# EAGLE design CityFireFly_3.1v (EAGLE 7.5.0)
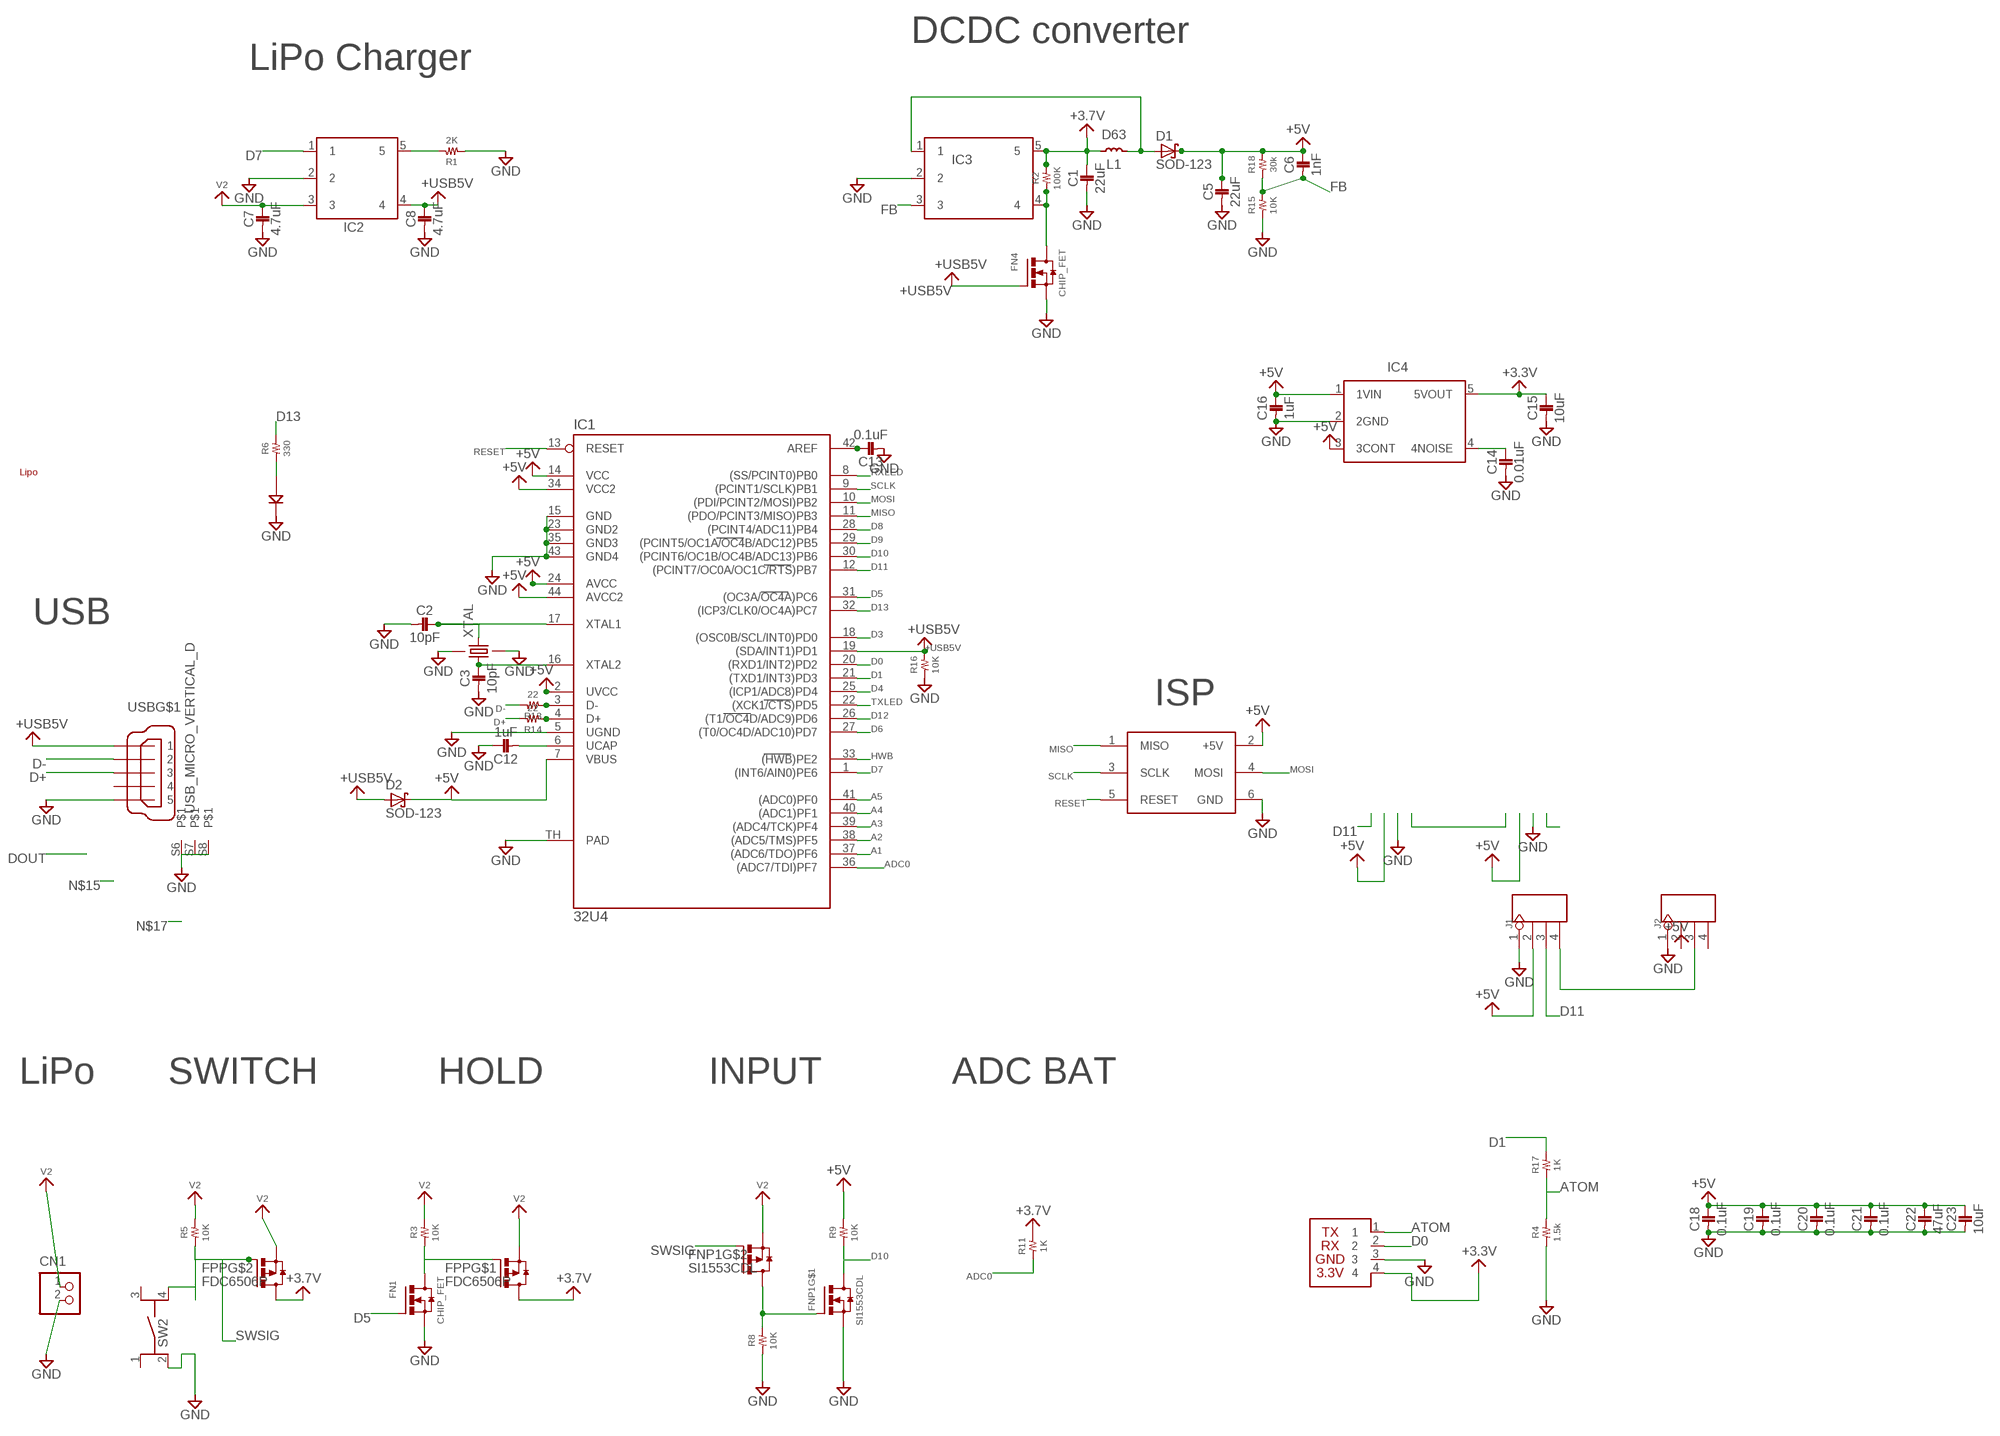
[diagram p0: schematic, sheet 1]

## Parts
BLE  BLE_SERIAL2_NO_HOLE  [BLESERIAL2_NO_HOLE]
C1  22uF  1608  [1608]
C2  10pF  1005  [1005]
C3  10pF  1005  [1005]
C5  22uF  1608  [1608]
C6  1nF  1005  [1005]
C7  4.7uF  1005  [1005]
C8  4.7uF  1005  [1005]
C12  1uF  1005  [1005]
C13  0.1uF  1005  [1005]
C14  0.01uF  1608  [1608]
C15  10uF  1608  [1608]
C16  1uF  1005  [1005]
C18  0.1uF  1005  [1005]
C19  0.1uF  1005  [1005]
C20  0.1uF  1005  [1005]
C21  0.1uF  1005  [1005]
C22  47uF  1608  [1608]
C23  10uF  1608  [1608]
CN1  S2B-PH-K-S  [S2B-PH-K-S]
D1  SOD-123  [SOD_123]
D2  SOD-123  [SOD_123]
FN1  CHIP_FET  [SOT23]
FN4  CHIP_FET  [SOT23]
FNP1  SI1553CDL  [SOT363]
FPP  FDC6506P  [SOT23-6]
IC1  32U4  ATMEGA32U4  [QFN-44-7X7]
IC2  MCP73831  [SOT23-5L]
IC3  LM2735  [SOT23-5L]
IC4  TAR5SB  [SSOP5-P-0.95]
J1  HEADER-4PFEMALE-LEFT  [4P-2.0-65/35MIL-90D-FEMALE-LEFT]
J2  HEADER-4PFEMALE-LEFT  [4P-2.0-65/35MIL-90D-FEMALE-LEFT]
L1  D63  [TOKO]
LED1  3MMLED  [3MM]
R1  2K  RESISTOR_1005  [1005]
R2  100K  RESISTOR_1005  [1005]
R3  10K  RESISTOR_1005  [1005]
R4  1.5k  RESISTOR_1005  [1005]
R5  10K  RESISTOR_1005  [1005]
R6  330  RESISTOR_1005  [1005]
R8  10K  RESISTOR_1005  [1005]
R9  10K  RESISTOR_1005  [1005]
R11  1K  RESISTOR_1005  [1005]
R13  22  RESISTOR_1005  [1005]
R14  22  RESISTOR_1005  [1005]
R15  10K  RESISTOR_1005  [1005]
R16  10K  RESISTOR_1005  [1005]
R17  1K  RESISTOR_1005  [1005]
R18  30k  RESISTOR_1005  [1005]
SW2  SKRPACE010  [SKRP]
U$3  ICSP  [ICSP]
U$68  LIPO500MAH  [LIPO500MAH]
USB  USB_MICRO_VERTICAL_D  [USB_MICRO_VERTICAL_D]
XTAL  FA-238  [FA-238]

## Nets
+3.3V: BLE.4 C15.P$1 IC4.5(5VOUT)
+3.7V: C1.P$1 FPP.4(D) FPP.6(D) IC3.5 L1.1 R2.2 R11.2
+5V: C5.P$1 C6.1 C16.1 C18.1 C19.1 C20.1 C21.1 C22.P$1 C23.P$1 D1.C D2.C IC1.2(UVCC) IC1.7(VBUS) IC1.14(VCC) IC1.24(AVCC) IC1.34(VCC2) IC1.44(AVCC2) IC4.1(1VIN) IC4.3(3CONT) J1.2 J2.2 R9.2 R18.2 U$3.2(+5V)
+USB5V: C8.1 D2.A FN4.1(G) IC1.19((SDA/INT1)PD1) IC2.4 R16.2 USB.1
A1: IC1.37((ADC6/TDO)PF6)
A2: IC1.38((ADC5/TMS)PF5)
A3: IC1.39((ADC4/TCK)PF4)
A4: IC1.40((ADC1)PF1)
A5: IC1.41((ADC0)PF0)
ADC0: IC1.36((ADC7/TDI)PF7) R11.1
ATOM: BLE.1 R4.2 R17.1
D0: BLE.2 IC1.20((RXD1/INT2)PD2)
D1: IC1.21((TXD1/INT3)PD3) R17.2
D3: IC1.18((OSC0B/SCL/INT0)PD0)
D4: IC1.25((ICP1/ADC8)PD4)
D5: FN1.1(G) IC1.31((OC3A/OC4A)PC6)
D6: IC1.27((T0/OC4D/ADC10)PD7)
D7: IC1.1((INT6/AIN0)PE6) IC2.1
D8: IC1.28((PCINT4/ADC11)PB4)
D9: IC1.29((PCINT5/OC1A/OC4B/ADC12)PB5)
D10: FNP1.6(D) IC1.30((PCINT6/OC1B/OC4B/ADC13)PB6) R9.1
D11: IC1.12((PCINT7/OC0A/OC1C/RTS)PB7) J1.3
D12: IC1.26((T1/OC4D/ADC9)PD6)
D13: IC1.32((ICP3/CLK0/OC4A)PC7) R6.2
D+: R14.2 USB.3
D-: R13.2 USB.2
DL: D1.A IC3.1 L1.2
DOUT: J1.4 J2.3
FB: C6.2 IC3.3 R15.2 R18.1
GND: BLE.3 C1.P$2 C2.2 C3.2 C5.P$2 C7.2 C8.2 C12.1 C13.2 C14.P$2 C15.P$2 C16.2 C18.2 C19.2 C20.2 C21.2 C22.P$2 C23.P$2 CN1.2 FN1.2(S) FN4.2(S) FNP1.1(S) IC1.5(UGND) IC1.15(GND) IC1.23(GND2) IC1.35(GND3) IC1.43(GND4) IC1.TH(PAD) IC2.2 IC3.2 IC4.2(2GND) J1.1 J2.1 LED1.K R1.1 R4.1 R8.1 R15.1 R16.1 SW2.2(1_) U$3.6(GND) USB.5 USB.S6 USB.S7 USB.S8 XTAL.2 XTAL.4
HWB: IC1.33((HWB)PE2)
MISO: IC1.11((PDO/PCINT3/MISO)PB3) U$3.1(MISO)
MOSI: IC1.10((PDI/PCINT2/MOSI)PB2) U$3.4(MOSI)
N$1: LED1.A R6.1
N$2: IC2.5 R1.2
N$3: FN4.3(D) IC3.4 R2.1
N$6: FN1.3(D) FPP.1(G) R3.1
N$7: C3.1 IC1.16(XTAL2) XTAL.1
N$8: IC1.3(D-) R13.1
N$9: C13.1 IC1.42(AREF)
N$10: C2.1 IC1.17(XTAL1) XTAL.3
N$14: IC1.4(D+) R14.1
N$16: C14.P$1 IC4.4(4NOISE)
N$18: C12.2 IC1.6(UCAP)
RESET: IC1.13(RESET) U$3.5(RESET)
RXLED: IC1.8((SS/PCINT0)PB0)
SCLK: IC1.9((PCINT1/SCLK)PB1) U$3.3(SCLK)
SIG: FNP1.2(G) FNP1.3(D) R8.2
SWSIG: FNP1.5(G) FPP.3(G) R5.1 SW2.4(2_)
TXLED: IC1.22((XCK1/CTS)PD5)
V2: C7.1 CN1.1 FNP1.4(S) FPP.2(S) FPP.5(S) IC2.3 R3.2 R5.2
Unconnected: J2.4 SW2.1 SW2.3 USB.4

## Notes on the sheet
- DCDC converter
- LiPo Charger
- USB
- ISP
- LiPo | SWITCH | HOLD | INPUT | ADC BAT

## Library data of the parts
BLE = 12_module:BLE_SERIAL2_NO_HOLE
C1 C5 C14 C15 C22 C23 = 02_C:1608
C2 C3 C6-C8 C12 C13 C16 C18-C21 = 02_C:1005
CN1 = jst-ph1:S2B-PH-*: Wire-to-Board 2.0mm pitch side mount connector Source: http://www.jst-mfg.com/product/pdf/jpn/PH.pdf http://www.jst-mfg.com/product/detail.php?series=199
D1 D2 = 15_DIODE:SOD-123
FN1 FN4 = 06_FET:CHIP_FET
FNP1 = 06_FET:SI1553CDL
FPP = 06_FET:FDC6506P
IC1 = 04_IC:ATMEGA32U4
IC2 = 04_IC:MCP73831
IC3 = 04_IC:LM2735
IC4 = 04_IC:TAR5SB
J1 J2 = Connector :HEADER-4P
L1 = 03_L:D63
LED1 = 10_LED:3MMLED
R1-R6 R8 R9 R11 R13-R18 = 01_R:RESISTOR_1005
SW2 = 09_1_switch:SKRPACE010
U$3 = 08_CONECTOR:ICSP
U$68 = 16_battery:LIPO500MAH
USB = 08_CONECTOR:USB_MICRO_VERTICAL_D
XTAL = 09_2_CRYSTAL:FA-238

## Net classes
1 POWER: width 0.5 mm, clearance 0.5 mm

## Board
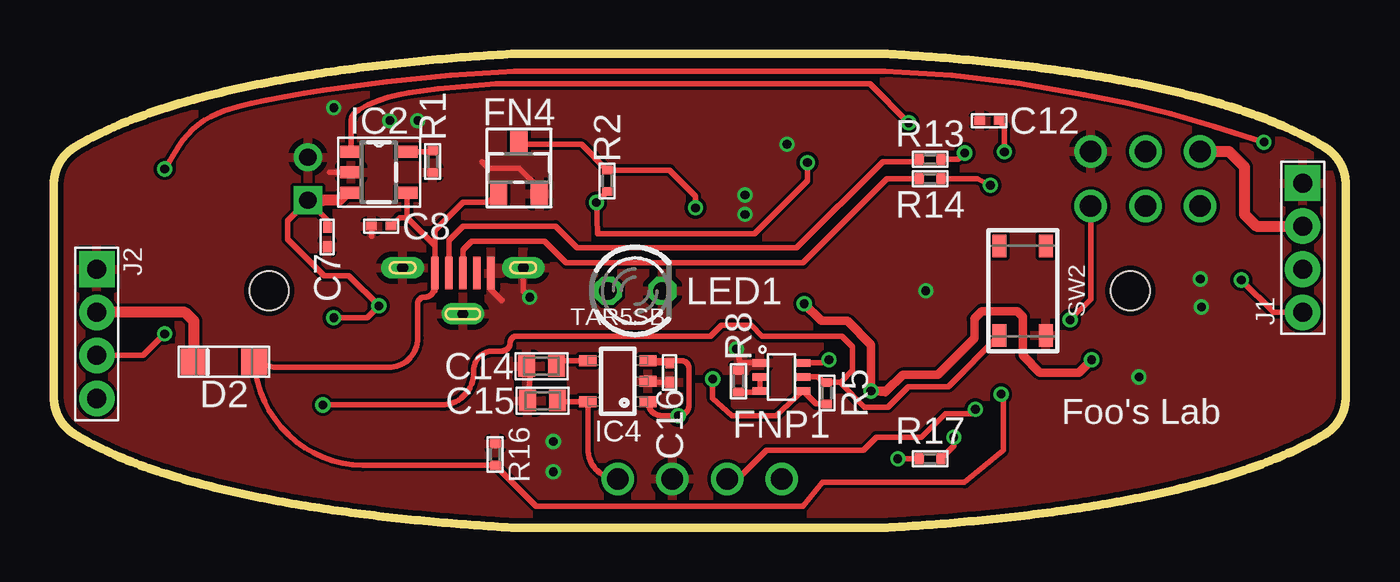
[diagram p1: board, top side]
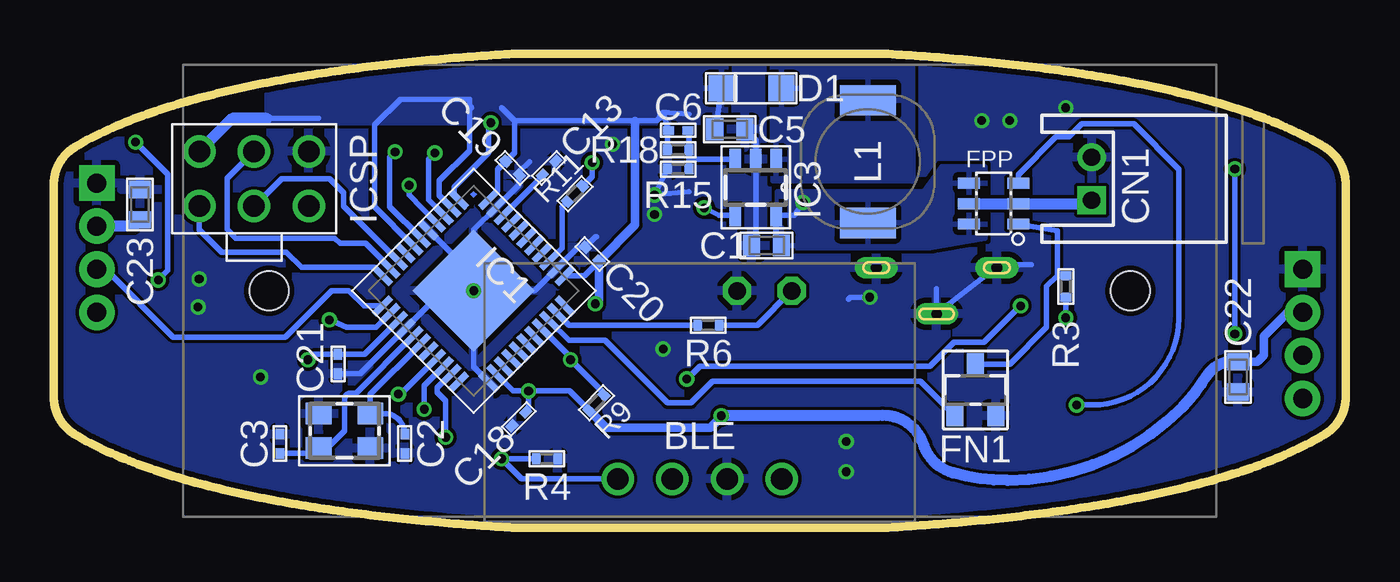
[diagram p2: board, bottom side, seen from below]

Size 60 x 22 mm. Coordinates in mm from the lower left corner, seen from the top.
Outline: 38.6,0 38.61,0 38.62,0 38.62,0 38.63,0 38.63,0 38.64,0 38.65,0 38.66,0 38.66,0 38.67,0 38.68,0 38.68,0 38.69,0 38.7,0 38.7,0 38.71,0 38.72,0 38.83,0.01 39.05,0.02 39.26,0.04 39.48,0.05 39.7,0.07 39.91,0.08 40.13,0.1 40.34,0.11 40.56,0.13 40.77,0.14 40.99,0.16 41.21,0.18 41.42,0.19 41.64,0.21 41.85,0.23 42.07,0.25 42.28,0.27 42.5,0.29 42.71,0.31 42.93,0.33 43.15,0.35 43.36,0.37 43.58,0.39 43.79,0.42 44.01,0.44 44.22,0.46 44.44,0.49 44.65,0.51 44.87,0.54 45.08,0.56 45.3,0.59 45.51,0.61 45.73,0.64 45.94,0.67 46.16,0.7 46.37,0.73 46.59,0.76 46.8,0.79 47.01,0.82 47.23,0.85 47.44,0.88 47.66,0.91 47.87,0.94 48.09,0.98 48.3,1.01 48.51,1.05 48.73,1.08 48.94,1.12 49.16,1.16 49.37,1.2 49.58,1.24 49.8,1.28 50.01,1.32 50.23,1.36 50.44,1.4 50.65,1.44 50.87,1.49 51.08,1.53 51.29,1.58 51.51,1.63 51.72,1.67 51.93,1.72 52.14,1.77 52.35,1.82 52.56,1.88 52.78,1.93 52.99,1.98 53.2,2.04 53.41,2.09 53.62,2.15 53.83,2.21 54.03,2.27 54.24,2.33 54.45,2.4 54.66,2.46 54.87,2.52 55.07,2.59 55.28,2.66 55.49,2.73 55.69,2.8 55.9,2.88 56.1,2.95 56.31,3.03 56.51,3.11 56.71,3.19 56.91,3.27 57.11,3.36 57.31,3.45 57.51,3.54 57.71,3.63 57.91,3.72 58.1,3.82 58.3,3.92 58.49,4.02 58.68,4.13 58.87,4.24 59.04,4.34 59.05,4.35 59.06,4.35 59.06,4.36 59.07,4.36 59.07,4.36 59.08,4.37 59.08,4.37 59.09,4.37 59.09,4.38 59.1,4.38 59.1,4.38 59.11,4.39 59.12,4.39 59.12,4.39 59.13,4.4 59.13,4.4 59.14,4.41 59.14,4.41 59.15,4.41 59.15,4.42 59.16,4.42 59.16,4.42 59.17,4.43 59.17,4.43 59.18,4.44 59.19,4.44 59.19,4.44 59.2,4.45 59.2,4.45 59.21,4.46 59.21,4.46 59.22,4.46 59.22,4.47 59.23,4.47 59.23,4.48 59.24,4.48 59.24,4.49 59.25,4.49 59.25,4.49 59.26,4.5 59.26,4.5 59.27,4.51 59.27,4.51 59.28,4.51 59.28,4.52 59.29,4.52 59.3,4.53 59.3,4.53 59.31,4.54 59.31,4.54 59.32,4.54 59.33,4.55 59.33,4.56 59.34,4.56 59.34,4.57 59.35,4.57 59.35,4.58 59.36,4.58 59.36,4.58 59.37,4.59 59.37,4.59 59.38,4.6 59.38,4.6 59.39,4.61 59.39,4.61 59.4,4.62 59.41,4.63 59.41,4.63 59.41,4.64 59.42,4.64 59.42,4.65 59.43,4.65 59.43,4.66 59.44,4.66 59.44,4.67 59.45,4.67 59.45,4.68 59.46,4.68 59.46,4.69 59.47,4.69 59.47,4.7 59.48,4.7 59.48,4.71 59.48,4.71 59.49,4.72 59.49,4.72 59.5,4.73 59.51,4.74 59.51,4.74 59.52,4.75 59.52,4.75 59.53,4.76 59.53,4.76 59.53,4.77 59.54,4.77 59.54,4.78 59.55,4.78 59.55,4.79 59.56,4.79 59.56,4.8 59.56,4.8 59.57,4.81 59.57,4.82 59.58,4.82 59.58,4.83 59.59,4.83 59.59,4.84 59.59,4.84 59.6,4.85 59.6,4.85 59.61,4.86 59.61,4.87 59.62,4.87 59.62,4.88 59.63,4.89 59.63,4.89 59.63,4.9 59.64,4.91 59.64,4.91 59.65,4.92 59.65,4.92 59.65,4.93 59.66,4.93 59.66,4.94 59.67,4.94 59.67,4.95 59.67,4.96 59.68,4.96 59.68,4.97 59.69,4.97 59.69,4.98 59.69,4.99 59.7,4.99 59.7,5 59.7,5 59.71,5.01 59.71,5.02 59.72,5.03 59.72,5.03 59.73,5.04 59.73,5.04 59.73,5.05 59.73,5.06 59.74,5.06 59.74,5.07 59.74,5.07 59.75,5.08 59.75,5.09 59.76,5.09 59.76,5.1 59.76,5.11 59.77,5.11 59.77,5.12 59.77,5.12 59.78,5.13 59.78,5.14 59.78,5.15 59.79,5.16 59.79,5.17 59.8,5.18 59.81,5.2 59.81,5.2 59.81,5.21 59.82,5.22 59.82,5.22 59.82,5.23 59.83,5.24 59.83,5.24 59.83,5.25 59.83,5.25 59.84,5.26 59.84,5.27 59.84,5.27 59.85,5.28 59.85,5.29 59.85,5.29 59.85,5.3 59.86,5.31 59.86,5.32 59.87,5.33 59.87,5.34 59.87,5.34 59.87,5.35 59.88,5.37 59.88,5.38 59.88,5.38 59.89,5.39 59.89,5.39 59.89,5.4 59.89,5.41 59.9,5.42 59.9,5.42 59.9,5.43 59.9,5.43 59.9,5.44 59.91,5.45 59.91,5.46 59.91,5.47 59.92,5.49 59.92,5.49 59.92,5.51 59.93,5.51 59.93,5.52 59.93,5.53 59.93,5.53 59.93,5.54 59.94,5.55 59.94,5.55 59.94,5.56 59.94,5.57 59.94,5.57 59.95,5.58 59.95,5.59 59.95,5.62 59.95,5.62 59.96,5.64 59.96,5.64 59.96,5.65 59.96,5.66 59.96,5.67 59.96,5.67 59.97,5.68 59.97,5.68 59.97,5.69 59.97,5.7 59.97,5.7 59.97,5.71 59.97,5.72 59.97,5.72 59.97,5.73 59.98,5.74 59.98,5.74 59.98,5.75 59.98,5.76 59.98,5.76 59.98,5.77 59.98,5.78 59.98,5.79 59.98,5.8 59.98,5.8 59.99,5.81 59.99,5.82 59.99,5.82 59.99,5.83 59.99,5.84 59.99,5.85 59.99,5.86 59.99,5.87 59.99,5.89 59.99,5.9 59.99,5.9 59.99,5.91 59.99,5.92 60,5.92 60,5.93 60,5.94 60,5.95 60,5.96 60,5.97 60,5.97 60,5.98 60,6 60,6 60,6.01 60,6.02 60,15.97 60,15.98 60,16 60,16 60,16.01 60,16.02 60,16.02 60,16.03 60,16.04 60,16.05 60,16.05 60,16.07 59.99,16.08 59.99,16.08 59.99,16.09 59.99,16.1 59.99,16.1 59.99,16.11 59.99,16.12 59.99,16.12 59.99,16.14 59.99,16.15 59.99,16.16 59.99,16.17 59.99,16.18 59.99,16.18 59.98,16.19 59.98,16.2 59.98,16.2 59.98,16.21 59.98,16.22 59.98,16.22 59.98,16.24 59.98,16.24 59.98,16.25 59.98,16.26 59.98,16.26 59.97,16.27 59.97,16.28 59.97,16.28 59.97,16.29 59.97,16.3 59.97,16.3 59.97,16.31 59.97,16.32 59.97,16.32 59.96,16.33 59.96,16.34 59.96,16.35 59.96,16.36 59.96,16.36 59.95,16.38 59.95,16.38 59.95,16.4 59.95,16.41 59.94,16.43 59.94,16.43 59.94,16.44 59.94,16.45 59.93,16.45 59.93,16.46 59.93,16.47 59.93,16.47 59.93,16.48 59.92,16.49 59.92,16.49 59.91,16.55 59.91,16.55 59.9,16.56 59.9,16.57 59.9,16.57 59.9,16.58 59.89,16.59 59.89,16.6 59.89,16.61 59.89,16.61 59.88,16.62 59.88,16.62 59.88,16.64 59.88,16.64 59.87,16.66 59.86,16.68 59.86,16.68 59.85,16.7 59.85,16.71 59.85,16.71 59.84,16.73 59.84,16.73 59.84,16.74 59.83,16.75 59.83,16.75 59.83,16.76 59.83,16.77 59.82,16.77 59.82,16.78 59.82,16.78 59.81,16.79 59.81,16.8 59.8,16.82 59.8,16.82 59.8,16.83 59.79,16.83 59.79,16.84 59.79,16.85 59.78,16.85 59.78,16.86 59.78,16.86 59.77,16.88 59.77,16.88 59.76,16.89 59.76,16.89 59.76,16.9 59.76,16.91 59.75,16.91 59.75,16.92 59.74,16.93 59.73,16.95 59.72,16.96 59.72,16.97 59.72,16.97 59.71,16.98 59.7,17 59.7,17 59.7,17.01 59.69,17.02 59.69,17.02 59.68,17.03 59.68,17.03 59.68,17.04 59.67,17.04 59.67,17.05 59.66,17.06 59.66,17.07 59.64,17.09 59.63,17.1 59.63,17.11 59.63,17.11 59.62,17.12 59.62,17.12 59.61,17.13 59.6,17.14 59.6,17.14 59.6,17.15 59.59,17.16 59.59,17.16 59.58,17.17 59.58,17.17 59.58,17.18 59.57,17.18 59.57,17.19 59.56,17.19 59.56,17.2 59.55,17.2 59.55,17.21 59.54,17.22 59.54,17.23 59.52,17.24 59.51,17.26 59.5,17.27 59.48,17.29 59.47,17.3 59.47,17.3 59.47,17.31 59.46,17.31 59.46,17.32 59.45,17.33 59.44,17.33 59.44,17.34 59.43,17.34 59.43,17.35 59.42,17.35 59.42,17.36 59.41,17.37 59.4,17.37 59.4,17.38 59.39,17.38 59.39,17.39 59.38,17.39 59.38,17.4 59.37,17.41 59.36,17.41 59.35,17.42 59.34,17.43 59.34,17.43 59.33,17.44 59.33,17.44 59.33,17.45 59.32,17.45 59.31,17.45 59.3,17.46 59.29,17.47 59.29,17.48 59.28,17.48 59.27,17.49 59.27,17.49 59.26,17.5 59.26,17.5 59.25,17.51 59.25,17.51 59.24,17.52 59.24,17.52 59.23,17.52 59.23,17.53 59.22,17.53 59.22,17.54 59.21,17.54 59.21,17.54 59.2,17.55 59.2,17.55 59.18,17.56 59.18,17.56 59.17,17.57 59.17,17.57 59.16,17.57 59.16,17.58 59.15,17.59 59.14,17.59 59.14,17.59 59.12,17.6 59.11,17.61 59.1,17.61 59.1,17.62 59.08,17.63 59.06,17.64 59.06,17.64 59.05,17.65 59,17.68 58.82,17.79 58.63,17.9 58.44,18 58.25,18.1 58.05,18.2 57.86,18.3 57.67,18.39 57.47,18.48 57.27,18.57 57.08,18.66 56.88,18.74 56.68,18.82 56.48,18.9 56.28,18.98 56.08,19.05 55.88,19.13 55.68,19.2 55.48,19.27 55.28,19.34 55.07,19.41 54.87,19.47 54.67,19.54 54.46,19.6 54.26,19.66 54.05,19.72 53.85,19.78 53.64,19.84 53.44,19.9 53.23,19.95 53.02,20.01 52.82,20.06 52.61,20.11 52.4,20.16 52.2,20.21 51.99,20.26 51.78,20.31 51.57,20.36 51.36,20.41 51.15,20.45 50.94,20.5 50.73,20.54 50.52,20.58 50.31,20.62 50.1,20.66 49.89,20.7 49.68,20.75 49.47,20.78 49.26,20.82 49.04,20.86 48.83,20.9 48.62,20.93 48.41,20.97 48.2,21 47.99,21.04 47.77,21.07 47.56,21.1 47.35,21.13 47.14,21.16 46.93,21.2 46.72,21.23 46.5,21.25 46.29,21.28 46.08,21.31 45.87,21.34 45.65,21.37 45.44,21.39 45.23,21.42 45.02,21.45 44.8,21.47 44.59,21.5 44.38,21.52 44.17,21.54 43.95,21.57 43.74,21.59 43.53,21.61 43.32,21.63 43.1,21.65 42.89,21.68 42.68,21.7 42.47,21.71 42.25,21.73 42.04,21.75 41.83,21.77 41.62,21.79 41.4,21.81 41.19,21.82 40.98,21.84 40.76,21.86 40.55,21.87 40.34,21.89 40.12,21.91 39.91,21.92 39.7,21.93 39.48,21.95 39.27,21.96 39.06,21.98 38.84,21.99 38.72,22 38.71,22 38.7,22 38.7,22 38.69,22 38.68,22 38.68,22 38.67,22 38.66,22 38.65,22 38.64,22 38.64,22 38.62,22 38.62,22 38.61,22 21.39,22 21.39,22 21.38,22 21.37,22 21.37,22 21.36,22 21.35,22 21.34,22 21.33,22 21.32,22 21.31,22 21.3,22 21.29,22 21.27,22 21.05,21.98 20.84,21.97 20.62,21.96 20.41,21.94 20.19,21.93 19.97,21.91 19.76,21.9 19.54,21.88 19.33,21.87 19.11,21.85 18.89,21.83 18.68,21.82 18.46,21.8 18.25,21.78 18.03,21.76 17.82,21.74 17.6,21.72 17.39,21.7 17.17,21.68 16.95,21.66 16.74,21.64 16.52,21.62 16.31,21.6 16.09,21.57 15.88,21.55 15.66,21.53 15.45,21.5 15.23,21.48 15.02,21.45 14.8,21.43 14.59,21.4 14.37,21.37 14.16,21.34 13.95,21.32 13.73,21.29 13.52,21.26 13.3,21.23 13.09,21.2 12.87,21.17 12.66,21.14 12.44,21.11 12.23,21.07 12.01,21.04 11.8,21 11.59,20.97 11.37,20.93 11.16,20.9 10.94,20.86 10.73,20.82 10.52,20.78 10.3,20.74 10.09,20.7 9.87,20.66 9.66,20.62 9.45,20.58 9.23,20.53 9.02,20.49 8.81,20.44 8.6,20.4 8.38,20.35 8.17,20.3 7.96,20.25 7.75,20.2 7.53,20.15 7.32,20.1 7.11,20.04 6.9,19.99 6.69,19.93 6.48,19.88 6.27,19.82 6.06,19.76 5.85,19.7 5.64,19.64 5.44,19.57 5.23,19.51 5.02,19.44 4.82,19.37 4.61,19.3 4.4,19.23 4.2,19.16 3.99,19.09 3.79,19.01 3.59,18.93 3.38,18.85 3.18,18.77 2.98,18.68 2.78,18.6 2.58,18.51 2.38,18.42 2.19,18.32 1.99,18.23 1.79,18.13 1.6,18.03 1.41,17.92 1.22,17.82 1.03,17.7 0.95,17.66 0.95,17.65 0.94,17.65 0.94,17.64 0.93,17.64 0.93,17.64 0.92,17.63 0.91,17.63 0.91,17.63 0.9,17.62 0.9,17.62 0.89,17.62 0.89,17.61 0.88,17.61 0.88,17.61 0.87,17.6 0.86,17.6 0.86,17.59 0.85,17.59 0.85,17.59 0.84,17.58 0.84,17.58 0.83,17.58 0.83,17.57 0.82,17.57 0.81,17.56 0.81,17.56 0.8,17.55 0.79,17.54 0.79,17.54 0.78,17.54 0.77,17.53 0.77,17.53 0.76,17.52 0.76,17.52 0.75,17.52 0.75,17.51 0.74,17.51 0.74,17.5 0.73,17.5 0.73,17.49 0.72,17.49 0.72,17.49 0.71,17.48 0.71,17.48 0.7,17.47 0.69,17.46 0.68,17.45 0.67,17.45 0.66,17.44 0.66,17.43 0.65,17.43 0.65,17.42 0.64,17.42 0.64,17.41 0.63,17.41 0.63,17.41 0.62,17.4 0.62,17.4 0.61,17.39 0.61,17.39 0.6,17.38 0.6,17.38 0.59,17.37 0.59,17.37 0.58,17.36 0.58,17.36 0.57,17.35 0.57,17.35 0.56,17.34 0.56,17.34 0.56,17.33 0.55,17.33 0.55,17.32 0.54,17.32 0.54,17.31 0.53,17.31 0.53,17.3 0.52,17.3 0.52,17.29 0.51,17.29 0.51,17.28 0.5,17.28 0.5,17.27 0.49,17.27 0.49,17.26 0.49,17.26 0.48,17.25 0.48,17.25 0.47,17.24 0.47,17.24 0.46,17.23 0.46,17.23 0.46,17.22 0.45,17.22 0.45,17.21 0.44,17.2 0.44,17.2 0.43,17.19 0.43,17.19 0.42,17.18 0.42,17.18 0.42,17.17 0.41,17.17 0.41,17.16 0.4,17.16 0.4,17.15 0.4,17.14 0.39,17.14 0.39,17.13 0.38,17.13 0.38,17.12 0.38,17.12 0.37,17.11 0.37,17.11 0.36,17.1 0.36,17.09 0.35,17.09 0.35,17.08 0.35,17.08 0.34,17.07 0.34,17.07 0.34,17.06 0.33,17.05 0.33,17.05 0.32,17.04 0.32,17.04 0.32,17.03 0.31,17.03 0.31,17.02 0.31,17.01 0.3,17.01 0.3,17 0.29,17 0.29,16.99 0.29,16.98 0.28,16.98 0.28,16.97 0.28,16.97 0.27,16.96 0.27,16.95 0.27,16.95 0.26,16.94 0.26,16.94 0.26,16.93 0.25,16.93 0.25,16.92 0.25,16.91 0.24,16.91 0.24,16.9 0.24,16.89 0.23,16.89 0.23,16.88 0.23,16.88 0.22,16.87 0.22,16.86 0.22,16.86 0.21,16.85 0.21,16.84 0.21,16.84 0.2,16.83 0.2,16.83 0.2,16.82 0.2,16.81 0.19,16.81 0.19,16.8 0.19,16.8 0.18,16.79 0.18,16.78 0.18,16.78 0.17,16.77 0.17,16.76 0.17,16.76 0.17,16.75 0.16,16.75 0.16,16.74 0.16,16.73 0.16,16.73 0.15,16.72 0.15,16.71 0.15,16.71 0.15,16.7 0.14,16.69 0.14,16.69 0.14,16.68 0.14,16.68 0.13,16.67 0.13,16.66 0.13,16.66 0.13,16.65 0.12,16.64 0.12,16.64 0.12,16.63 0.12,16.62 0.11,16.62 0.11,16.61 0.11,16.6 0.11,16.6 0.1,16.59 0.1,16.58 0.1,16.58 0.1,16.57 0.1,16.57 0.09,16.56 0.09,16.55 0.09,16.55 0.09,16.54 0.09,16.53 0.08,16.53 0.08,16.52 0.08,16.51 0.08,16.51 0.08,16.5 0.07,16.49 0.07,16.49 0.07,16.48 0.07,16.47 0.07,16.47 0.07,16.46 0.06,16.45 0.06,16.45 0.06,16.44 0.06,16.43 0.06,16.43 0.06,16.42 0.05,16.41 0.05,16.41 0.05,16.4 0.05,16.39 0.05,16.39 0.05,16.38 0.04,16.37 0.04,16.37 0.04,16.36 0.04,16.35 0.04,16.35 0.04,16.34 0.04,16.33 0.04,16.33 0.03,16.32 0.03,16.31 0.03,16.31 0.03,16.3 0.03,16.29 0.03,16.29 0.03,16.28 0.03,16.27 0.03,16.27 0.02,16.26 0.02,16.25 0.02,16.25 0.02,16.24 0.02,16.23 0.02,16.23 0.02,16.22 0.02,16.21 0.02,16.21 0.02,16.2 0.01,16.2 0.01,16.19 0.01,16.18 0.01,16.18 0.01,16.17 0.01,16.16 0.01,16.16 0.01,16.15 0.01,16.14 0.01,16.14 0.01,16.13 0.01,16.12 0.01,16.12 0.01,16.11 0.01,16.1 0.01,16.1 0.01,16.09 0,16.08 0,16.08 0,16.07 0,16.06 0,16.06 0,16.05 0,16.04 0,16.04 0,16.03 0,16.02 0,16.02 0,16.01 0,16 0,16 0,15.99 0,15.98 0,15.98 0,15.97 0,15.96 0,15.96 0,15.95 0,6.05 0,6.04 0,6.04 0,6.03 0,6.02 0,6.01 0,6.01 0,6 0,6 0,5.99 0,5.98 0,5.98 0,5.97 0,5.96 0,5.96 0,5.95 0,5.94 0,5.94 0,5.93 0,5.92 0,5.92 0.01,5.91 0.01,5.9 0.01,5.9 0.01,5.89 0.01,5.88 0.01,5.88 0.01,5.87 0.01,5.86 0.01,5.86 0.01,5.85 0.01,5.84 0.01,5.84 0.01,5.83 0.01,5.83 0.01,5.82 0.01,5.81 0.01,5.8 0.02,5.8 0.02,5.79 0.02,5.79 0.02,5.78 0.02,5.77 0.02,5.76 0.02,5.76 0.02,5.75 0.02,5.75 0.02,5.74 0.03,5.73 0.03,5.73 0.03,5.72 0.03,5.71 0.03,5.71 0.03,5.7 0.03,5.69 0.03,5.69 0.04,5.68 0.04,5.67 0.04,5.67 0.04,5.66 0.04,5.65 0.04,5.65 0.04,5.64 0.04,5.63 0.05,5.63 0.05,5.62 0.05,5.61 0.05,5.61 0.05,5.6 0.05,5.59 0.06,5.59 0.06,5.58 0.06,5.57 0.06,5.57 0.06,5.56 0.06,5.55 0.07,5.55 0.07,5.54 0.07,5.53 0.07,5.53 0.07,5.52 0.07,5.51 0.07,5.51 0.08,5.5 0.08,5.49 0.08,5.49 0.08,5.48 0.09,5.47 0.09,5.47 0.09,5.46 0.09,5.46 0.09,5.45 0.1,5.44 0.1,5.43 0.1,5.43 0.1,5.42 0.1,5.42 0.11,5.41 0.11,5.4 0.11,5.4 0.11,5.39 0.12,5.38 0.12,5.38 0.12,5.37 0.12,5.36 0.12,5.36 0.13,5.35 0.13,5.34 0.13,5.34 0.13,5.33 0.14,5.33 0.14,5.32 0.14,5.31 0.14,5.31 0.15,5.3 0.15,5.29 0.15,5.29 0.15,5.28 0.16,5.27 0.16,5.27 0.16,5.26 0.17,5.25 0.17,5.25 0.17,5.24 0.17,5.24 0.18,5.23 0.18,5.22 0.18,5.22 0.18,5.21 0.19,5.21 0.19,5.2 0.19,5.19 0.2,5.19 0.2,5.18 0.2,5.17 0.21,5.17 0.21,5.16 0.21,5.16 0.21,5.15 0.22,5.14 0.22,5.14 0.22,5.13 0.23,5.12 0.23,5.12 0.23,5.11 0.24,5.11 0.24,5.1 0.24,5.09 0.25,5.09 0.25,5.08 0.25,5.08 0.26,5.07 0.26,5.06 0.26,5.06 0.27,5.05 0.27,5.04 0.28,5.04 0.28,5.03 0.28,5.03 0.28,5.02 0.29,5.02 0.29,5.01 0.3,5 0.3,5 0.3,4.99 0.31,4.99 0.31,4.98 0.31,4.97 0.32,4.97 0.32,4.96 0.33,4.96 0.33,4.95 0.33,4.95 0.34,4.94 0.34,4.93 0.34,4.93 0.35,4.92 0.35,4.92 0.36,4.91 0.36,4.91 0.36,4.9 0.37,4.89 0.37,4.89 0.38,4.88 0.38,4.88 0.38,4.87 0.39,4.87 0.39,4.86 0.4,4.86 0.4,4.85 0.41,4.84 0.41,4.84 0.41,4.83 0.42,4.83 0.42,4.82 0.43,4.82 0.43,4.81 0.43,4.81 0.44,4.8 0.44,4.79 0.45,4.79 0.45,4.79 0.46,4.78 0.46,4.77 0.47,4.77 0.47,4.76 0.47,4.76 0.48,4.75 0.48,4.75 0.49,4.74 0.49,4.74 0.5,4.73 0.5,4.73 0.51,4.72 0.51,4.72 0.51,4.71 0.52,4.71 0.52,4.7 0.53,4.7 0.53,4.69 0.54,4.69 0.54,4.68 0.55,4.68 0.55,4.67 0.56,4.67 0.56,4.66 0.57,4.66 0.57,4.65 0.57,4.65 0.58,4.64 0.58,4.64 0.59,4.63 0.59,4.63 0.6,4.62 0.6,4.62 0.61,4.61 0.61,4.61 0.62,4.61 0.62,4.6 0.63,4.59 0.63,4.59 0.64,4.59 0.64,4.58 0.65,4.58 0.65,4.57 0.66,4.57 0.66,4.56 0.67,4.56 0.67,4.55 0.68,4.55 0.68,4.54 0.69,4.54 0.69,4.54 0.7,4.53 0.7,4.53 0.71,4.52 0.71,4.52 0.72,4.51 0.72,4.51 0.73,4.51 0.73,4.5 0.74,4.5 0.74,4.49 0.75,4.49 0.76,4.49 0.76,4.48 0.77,4.48 0.77,4.47 0.78,4.47 0.78,4.46 0.79,4.46 0.79,4.46 0.8,4.45 0.8,4.45 0.81,4.45 0.81,4.44 0.82,4.44 0.82,4.43 0.83,4.43 0.83,4.42 0.84,4.42 0.84,4.42 0.85,4.41 0.86,4.41 0.86,4.41 0.87,4.4 0.87,4.4 0.88,4.39 0.88,4.39 0.89,4.39 0.89,4.38 0.9,4.38 0.91,4.38 0.91,4.37 0.92,4.37 0.92,4.37 0.93,4.36 0.93,4.36 0.94,4.36 0.94,4.35 0.95,4.35 0.95,4.35 1.08,4.27 1.27,4.16 1.46,4.05 1.65,3.95 1.84,3.85 2.04,3.75 2.23,3.66 2.42,3.56 2.62,3.48 2.82,3.39 3.02,3.3 3.21,3.22 3.41,3.14 3.61,3.06 3.81,2.98 4.01,2.91 4.21,2.84 4.41,2.77 4.62,2.7 4.82,2.63 5.02,2.56 5.22,2.5 5.43,2.43 5.63,2.37 5.84,2.31 6.04,2.25 6.25,2.19 6.45,2.13 6.66,2.08 6.87,2.02 7.07,1.97 7.28,1.92 7.49,1.86 7.69,1.81 7.9,1.76 8.11,1.71 8.32,1.67 8.53,1.62 8.74,1.57 8.95,1.53 9.16,1.48 9.37,1.44 9.58,1.4 9.79,1.36 10,1.31 10.21,1.27 10.42,1.24 10.63,1.2 10.84,1.16 11.05,1.12 11.27,1.09 11.48,1.05 11.69,1.01 11.9,0.98 12.11,0.95 12.32,0.91 12.54,0.88 12.75,0.85 12.96,0.82 13.17,0.79 13.38,0.76 13.6,0.73 13.81,0.7 14.02,0.67 14.23,0.65 14.45,0.62 14.66,0.59 14.87,0.57 15.08,0.54 15.29,0.52 15.51,0.49 15.72,0.47 15.93,0.45 16.14,0.42 16.36,0.4 16.57,0.38 16.78,0.36 16.99,0.34 17.21,0.32 17.42,0.29 17.63,0.28 17.84,0.26 18.06,0.24 18.27,0.22 18.48,0.2 18.7,0.18 18.91,0.17 19.12,0.15 19.34,0.13 19.55,0.12 19.76,0.1 19.98,0.09 20.19,0.07 20.4,0.06 20.61,0.04 20.83,0.03 21.04,0.02 21.25,0.01 21.29,0 21.29,0 21.3,0 21.31,0 21.31,0 21.32,0 21.33,0 21.33,0 21.34,0 21.35,0 21.35,0 21.36,0 21.37,0 21.38,0 21.38,0 21.39,0 21.39,0 38.6,0
Copper layers (1*16): Top 0.035mm / dielectric 1.5mm / Bottom 0.035mm
Design rules "SeeedStudio_2layer_DRU_no_angle_20140221": minimum track width 6mil, minimum drill 12mil, track to track 6mil, track to pad 6mil, pad to pad 6mil, via to via 6mil, smd to smd 0mil, copper to edge 10mil, drill to drill 10mil, minimum pad ring 10mil, minimum via ring 6mil, stop-mask expansion 2mil, vias tented up to drill 100mil, thermal gap 10mil
Holes 1.8 mm at 10,11 50,11
bKeepout: area 48.5,9.5 to 51.5,12.5; area 8.5,9.5 to 11.5,12.5

### Footprints (pad centres in the part's own frame; a part is rotated, then mirrored left to right if it is on the bottom)
BLESERIAL2_NO_HOLE = drill 1: 1 -3.81,-2.73; 2 -1.27,-2.73; 3 1.27,-2.73; 4 3.81,-2.73
1608 = smd 0.8 x 1: P$1 -0.7,0; P$2 0.7,0
1005 = smd 0.5 x 0.4: 1 -0.45,0; 2 0.45,0
S2B-PH-K-S = drill 0.8 square: 1 1,0 | drill 0.8: 2 -1,0
SOD_123 = smd 1.2 x 1.2: A -1.4,0; C 1.4,0
SOT23 = smd 0.8 x 1: 1 -0.95,-1.2; 2 0.95,-1.2; 3 0,1.2
SOT363 = smd 0.35 x 0.7: 1 -0.65,-1; 2 0,-1; 3 0.65,-1; 4 0.65,1; 5 0,1; 6 -0.65,1
SOT23-6 = smd 0.508 x 1.016: 1 -0.95,-1.143; 2 0,-1.143; 3 0.95,-1.143; 4 0.95,1.143; 5 0,1.143; 6 -0.95,1.143
QFN-44-7X7 = smd 1.1 x 0.3: 1 -3.5,2.5; 2 -3.5,2; 3 -3.5,1.5; 4 -3.5,1; 5 -3.5,0.5; 6 -3.5,0; 7 -3.5,-0.5; 8 -3.5,-1; 9 -3.5,-1.5; 10 -3.5,-2; 11 -3.5,-2.5; 23 3.5,-2.5; 24 3.5,-2; 25 3.5,-1.5; 26 3.5,-1; 27 3.5,-0.5; 28 3.5,0; 29 3.5,0.5; 30 3.5,1; 31 3.5,1.5; 32 3.5,2; 33 3.5,2.5 | smd 0.3 x 1.1: 12 -2.5,-3.5; 13 -2,-3.5; 14 -1.5,-3.5; 15 -1,-3.5; 16 -0.5,-3.5; 17 0,-3.5; 18 0.5,-3.5; 19 1,-3.5; 20 1.5,-3.5; 21 2,-3.5; 22 2.5,-3.5; 34 2.5,3.5; 35 2,3.5; 36 1.5,3.5; 37 1,3.5; 38 0.5,3.5; 39 0,3.5; 40 -0.5,3.5; 41 -1,3.5; 42 -1.5,3.5; 43 -2,3.5; 44 -2.5,3.5 | smd 4 x 4: TH 0,0
SOT23-5L = smd 0.55 x 1: 1 -0.95,-1.3; 2 0,-1.3; 3 0.95,-1.3; 4 0.95,1.3; 5 -0.95,1.3
SSOP5-P-0.95 = smd 0.5 x 0.8: 1 -0.95,-1.4; 2 0,-1.4; 3 0.95,-1.4; 4 0.95,1.4; 5 -0.95,1.4
4P-2.0-65/35MIL-90D-FEMALE-LEFT = drill 0.889 pad 1.651 square: 1 0,3 | drill 0.889 pad 1.651: 2 0,1; 3 0,-1; 4 0,-3
TOKO = smd 1.4 x 2.6: 1 -2.85,0; 2 2.85,0
3MM = drill 0.813 octagon: A 0,1.27; K 0,-1.27
1005' = smd 0.4 x 0.5: 1 -0.5,0; 2 0.5,0
SKRP = smd 1.05 x 0.65: 1 -2.075,1.075; 2 2.075,1.075; 3 -2.075,-1.075; 4 2.075,-1.075
ICSP = drill 1 pad 1.5: 1 -1.27,2.54; 2 1.27,2.54; 3 -1.27,0; 4 1.27,0; 5 -1.27,-2.54; 6 1.27,-2.54
USB_MICRO_VERTICAL_D = smd 0.35 x 1.5: 1 -1.3,0.825; 2 -0.65,0.825; 3 0,0.825; 4 0.65,0.825; 5 1.3,0.825 | drill 0.5 pad 1 long: S6 -2.8,1.075; S7 0,-1.075; S8 2.8,1.075
FA-238 = smd 1.2 x 1: 1 -1.2,-0.8; 2 1.2,-0.8; 3 1.2,0.8; 4 -1.2,0.8

### Placement (x,y rotation side)
BLE  30,5 0 bottom
C1  26.9,13.1 180 bottom
C2  43.7,3.9 270 bottom
C3  49.5,3.9 90 bottom
C5  28.6,18.5 0 bottom
C6  31,18.45 0 bottom
C7  12.7,13.5 270 top
C8  15.2,14 180 top
C12  43.45,18.9 0 top
C13  37,16.7 45 bottom
C14  22.65,7.5 180 top
C15  22.7,5.9 180 top
C16  28.6,7.2 270 top
C18  38.4,5.05 225 bottom
C19  38.7,16.7 315 bottom
C20  35,12.7 135 bottom
C21  46.8,7.6 270 bottom
C22  5,7 270 bottom
C23  56,15 90 bottom
CN1  11.8,16.2 270 bottom
D1  27.6,20.4 180 bottom
D2  7.9,7.7 180 top
FN1  17.2,6.4 0 bottom
FN4  21.6,16.7 0 top
FNP1  33.8,7 270 top
FPP  16.35,15.05 90 bottom
IC1  40.5,11 315 bottom
IC2  15.1,16.5 270 top
IC3  27.4,15.8 180 bottom
IC4  26.2,6.8 90 top
J1  58,13 0 top
J2  2,9 0 top
L1  22.2,17 90 bottom
LED1  27,11 90 top
R1  2K  [1005']  17.6,17 90 top
R2  100K  [1005']  25.7,16.1 270 top
R3  10K  [1005']  13,11.2 270 bottom
R4  1.5k  [1005']  37.1,3.2 180 bottom
R5  10K  [1005']  35.9,6.25 270 top
R6  330  [1005']  29.6,9.4 180 bottom
R8  10K  [1005']  31.8,6.8 270 top
R9  10K  [1005']  34.8,5.8 225 bottom
R11  1K  [1005']  35.8,15.5 45 bottom
R13  22  [1005']  40.7,17.1 180 top
R14  22  [1005']  40.7,16.2 180 top
R15  10K  [1005']  31,16.65 0 bottom
R16  10K  [1005']  20.5,3.4 270 top
R17  1K  [1005']  40.7,3.2 0 top
R18  30k  [1005']  31,17.55 180 bottom
SW2  45,11 270 top
U$3  50.7,16.2 90 bottom
U$68  30,11 180 bottom
USB  19,11 0 top
XTAL  46.5,4.5 0 bottom

### Tracks (layer width: path | path; a pad name or v marks a point on that pad's centre or on a via)
+3.3V
  Top 0.25: BLE.4 arc-90 24.8,3.66 IC4.5 23.45,5.85 C15.P$1
+3.7V  (via drill 0.4)
  Top 0.25: R2.2 v25.2,15.1 25.25,13.65 32.55,13.65 35,16.1 v35,16.95
  Bottom 0.25: C1.P$1 26.45,13.35 IC3.5 25.6,14.5 v25.2,15.1 | R11.2 35,16.3 v35,16.95
  pour Bottom: 26.4,15.6 19.6,15.6 18.75,16.75 16.75,16.75 16.75,13.45 19.3,13 26.4,13
+5V  (via drill 0.4)
  Top 0.25: IC4.1 arc90 28.25,5.2 v29,5.2 arc90 29.5,5.7 29.5,7.4 arc90 29.15,7.75 IC4.3 arc90 27.7,7.65 C16.1
  Top 0.4: 38.63,6.3 v37.95,6.35 | v48.2,7.8 47.6,7.2 45.8,7.2 45,8 45,9.8 44.75,10.05 43.1,10.05 42.75,9.7 42.75,8.8 41.05,7.1 39.43,7.1 38.68,6.35 v37.95,6.35 | v34.85,10.4 35.65,9.6 36.85,9.6 37.95,8.5 v37.95,6.35
  Top 0.5: U$3.2 54.58,17.47 55.3,16.75 55.3,14.55 55.85,14 J1.2 | J2.2 6.1,10 6.5,9.6 D2.C
  Bottom 0.25: D1.C 29.24,18.56 C5.P$1 | 30.5,19.2 31.7,19.3 C6.1 31.5,18.45 R18.2 | IC1.44 39.4,15.64 39.4,16.64 | 39.4,16.64 C19.1 | IC1.2 42.1,15.43 42.1,16.1 40.7,17.5 40.7,19.6 | IC1.34 35.36,11.71 C20.1 | IC1.7 45.1,14.89 45.1,18.7 43.9,19.9 40.7,19.9 40.7,19.6 | 50.11,19 47.7,19 | 48.15,7.85 v48.2,7.8 47.95,8.05 C21.1 45.57,8.05 IC1.14 | 39.4,16.64 39.36,16.64 38.6,17.4 38.6,18.9 | 38.6,18.9 39.2,19.5 | 40.6,19.5 40.7,19.6 | 38.6,18.9 33,18.9 32,18.9 31.73,19.18 31.6,19.3 | IC1.24 38.68,6.35 v37.95,6.35 | R9.2 36.06,6.35 v37.95,6.35 | C18.1 37.95,5.5 v37.95,6.35
  Bottom 0.4: 31.8,19.1 31.73,19.18 | v34.85,10.4 34.68,10.57 C20.1 33,14.06 33,18.9 | R9.2 34.36,4.65 29.5,4.65 29,5.15 v29,5.2 28.95,5.15 | C22.P$1 4.1,7.7 3.8,8 3.8,8.9 2.7,10 J2.2
  Bottom 0.5: v29,5.2 21.7,5.2 arc78 19.6,3.85 arc-56 18.25,2.55 arc-16 15.7,2.2 arc-45 7.55,5.65 arc-13 6.45,7.05 arc68 C22.P$1 | 50.11,19 51.71,19 U$3.2 | C23.P$1 56.3,14 J1.2
  pour Bottom: 28.75,23.35 28.8,18.8 50.1,18.8 50.1,23.4
+USB5V  (via drill 0.4)
  Top 0.25: IC2.4 16.4,14.4 | 16.4,14.4 17.7,13.1 | 17.7,13.1 USB.1 17.7,11.2 | C8.1 16.05,14.4 16.4,14.4 | 17.7,13.1 17.7,13.8 19,15.1 20.15,15.1 FN4.1 | 17.7,11 17.7,11.2 | v44,6.2 44.1,6.05 44.1,3.6 42.3,2.1 35.7,2.1 34.8,1 22.4,1 R16.2 14.84,2.9 arc-90 D2.A 10.2,7.44 15.54,7.44 arc90 16.9,8.8 16.9,10.4 arc-90 17.2,10.7 arc90 17.7,11.2
  Bottom 0.25: v44,6.2 44,6.24 43.85,6.24 IC1.19
ADC0
  Bottom 0.25: IC1.36 36.4,12.98 36.4,14.9 R11.1
ATOM  (via drill 0.4)
  Top 0.25: R17.1 v39.2,3.2
  Bottom 0.25: R4.2 v39.2,3.2 38.27,2.27 BLE.1
D0  (via drill 0.4)
  Top 0.25: v42.8,5.5 42.6,5.3 41.4,5.3 40.3,4.2 38.2,4.2 37.6,3.6 33.1,3.6 31.77,2.27 BLE.2
  Bottom 0.25: IC1.20 42.8,6.58 v42.8,5.5
D1  (via drill 0.4)
  Top 0.25: R17.2 41.8,3.8 v41.8,4.2
  Bottom 0.25: IC1.21 41.59,7.11 42.2,6.5 42.2,6.3 41.8,5.9 v41.8,4.2
D5
  Bottom 0.25: IC1.31 36.08,8.7 34.4,8.7 31.5,5.8 30.4,5.8 29.4,6.8 19.75,6.8 FN1.1
D7  (via drill 0.4)
  Top 0.25: IC2.1 13.8,18.8 arc-61 14.15,19.4 arc-21 16.5,20.2 arc-5 20.55,20.6 37.9,20.6 v39.7,18.8
  Bottom 0.25: IC1.1 41.4,15.44 41.4,15.8 39.8,17.4 39.8,18.7 v39.7,18.8
D10  (via drill 0.4)
  Top 0.25: FNP1.6 35.65,7.65 v36,7.8
  Bottom 0.25: R9.1 34.45,6.25 v36,7.8 36,7.91 IC1.30
D11
  Bottom 0.25: IC1.12 45.59,10.29 46.3,11 47.1,11 49.25,8.85 54.45,8.85 57.6,12 J1.3
D13
  Bottom 0.25: IC1.32 36.07,9.4 R6.2
D+
  Top 0.25: R14.2 38.7,16.2 34.8,12.3 23.8,12.3 22.8,13.3 19.4,13.3 19,12.9 USB.3
D-
  Top 0.25: USB.2 18.35,13.35 19,14 23.3,14 24.3,13 34.5,13 38.5,17 40.1,17 R13.2
DL
  pour Bottom (rank 3): 20.15,23.35 20.1,16.1 26.6,16.1 26.65,23.35
DOUT  (via drill 0.4)
  Top 0.25: J2.3 4.15,8 v5.15,9 | v55.15,11.5 56.65,10 J1.4 | v5.15,16.65 5.8,17.7 arc-40 7.9,19.35 arc-7 9.85,19.85 arc-2 12.5,20.3 arc-6 21.4,21.2 38.6,21.2 arc-10 47.85,20.1 arc-8 53.85,18.65 v56.2,17.9
  Bottom 0.25: v5.15,9 v5.15,16.65 | v56.2,17.9 54.7,16.4 54.7,11.95 v55.15,11.5
FB
  Bottom 0.25: IC3.3 30.5,17.1 R15.2 R18.1 30.5,18.45 C6.2
GND  (via drill 0.4)
  Top 0.25: IC2.2 12.8,16.5 | 27.3,6.9 IC4.2 arc90 27.65,6.75 C16.2 | R8.1 31.9,7.6 | 31.9,7.6 v31.7,8.3 | USB.S8 21.8,11 v22.1,10.7 | C8.2 14.75,13.53 | FN4.2 22.55,15.75 21.6,16.7 20.2,16.7 19.9,17 | 31.9,7.6 31.95,7.65 FNP1.1 | C14.P$2 22.2,7.8 C15.P$2
  Top 0.3: USB.5 20.3,11.05 20.8,10.55
  Bottom 0.25: C1.P$2 27.4,13.3 IC3.2 27.4,18 C5.P$2 | R15.1 v32.1,15.45 30.5,15.6 | IC1.TH 40.5,13.83 IC1.43 38.4,15.93 38.4,16.4 | C19.2 38.38,16.52 37.9,17 | IC1.5 40.5,11.71 IC1.TH | IC1.TH 41.91,11 IC1.15 45.76,7.15 C21.2 | IC1.23 40.5,7.46 IC1.TH | 34.8,13.5 34.84,13.5 C20.2 35.65,13.02 IC1.35 37.67,11 IC1.TH | 14.6,12.2 16.07,12.2 USB.S7 19,11.1 | v22.1,10.7 23,10.7 23.1,10.6
  other vias: 32.1,14.55 23.2,4 23.2,2.6 50.4,7 40.5,11 34.05,17.8 13,19.5 15.6,18.9 16.9,18.9 53.25,11.55 53.3,10.25
  pour Bottom (rank 6): -10,30 70,30 70,-5 -10,-5
  pour Top: -10,30 70,30 70,-5 -10,-5
MISO
  Bottom 0.25: IC1.11 45.14,12.1 48.5,12.1 49.2,12.8 52.2,12.8 53.24,13.84 U$3.1
MOSI
  Bottom 0.25: IC1.10 45.53,13.2 46.7,13.2 46.95,13.45 51.55,13.45 51.95,13.85 51.95,16.22 U$3.4
N$1
  Bottom 0.25: LED1.A 27.33,9.4 R6.1
N$2
  Top 0.25: IC2.5 17.55,17.45 R1.2
N$3  (via drill 0.4)
  Top 0.25: FN4.3 21.6,17.8 24.5,17.8 R2.1 28.6,16.6 29.8,15.4 v29.8,14.85
  Bottom 0.25: v29.8,14.85 29.1,14.5 IC3.4
N$6
  Bottom 0.25: 13.4,11.7 13.9,11.2 13.9,9.3 15.6,7.6 FN1.3 | 13.4,11.7 R3.1 | 13.4,11.7 13.4,13.79 FPP.1
N$7
  Bottom 0.25: C3.1 47.95,3.45 XTAL.1 47.3,3.7 46.5,4.5 46.5,5.95 arc90 46.2,6.25 45.96,6.25 IC1.16
N$8  (via drill 0.4)
  Top 0.25: v42.3,17.4 42,17.1 R13.1
  Bottom 0.25: 42.5,17.2 v42.3,17.4 42.6,17.1 42.6,15.22 IC1.3
N$9
  Bottom 0.25: IC1.42 37.32,16.3 C13.1
N$10
  Bottom 0.25: IC1.17 45.3,6.2 XTAL.3 44.65,5.3 arc90 C2.1
N$14  (via drill 0.4)
  Top 0.25: v43.5,15.9 42.9,16.2 R14.1
  Bottom 0.25: IC1.4 43.5,15.46 v43.5,15.9
N$16
  Top 0.25: IC4.4 23.6,7.75 C14.P$1
N$18  (via drill 0.4)
  Top 0.25: v44.15,17.45 44.15,18.6 C12.2
  Bottom 0.25: IC1.6 44.4,14.9 44.4,17.2 v44.15,17.45
RESET  (via drill 0.4)
  Top 0.25: v47.2,9.65 48.16,10.61 U$3.5
  Bottom 0.25: IC1.13 45.03,9.3 46.4,9.3 v47.2,9.65
SCLK
  Bottom 0.25: IC1.9 46.55,14.93 46.55,15.55 47.2,16.2 49.43,16.2 U$3.3
SIG
  Top 0.25: FNP1.2 FNP1.3 32.65,6.35 32.6,6.3 R8.2
SWSIG  (via drill 0.4)
  Top 0.25: v12.5,5.7 18,5.7 arc90 19.5,7.2 19.5,7.3 arc-90 20.4,8.2 20.8,8.2 arc90 21.2,8.6 arc-90 21.5,8.9 30.5,8.9 31,9.4 32.4,9.4 32.9,8.9 36.6,8.9 37.1,8.4 37.1,7.3 36.55,6.75 | FNP1.5 35.5,7 35.75,6.75 R5.1 36.55,6.75 | SW2.4 41.55,6.55 39.7,6.55 38.75,5.6 37.65,5.6 36.55,6.7 36.55,6.75
  Bottom 0.25: v12.5,5.7 11.8,5.7 arc-90 7.75,9.7 7.75,16.65 9.85,18.75 12.25,18.75 12.85,18.15 13.45,18.15 15.21,16.39 FPP.3
V2  (via drill 0.4)
  Top 0.25: 13.6,15.55 IC2.3 | v30.6,6.9 30.6,6 31.5,5.2 33.55,5.2 FNP1.4 35.4,5.75 R5.2 | 12.4,15.2 12.5,15.2 | v13,9.75 14.55,9.75 v15.1,10.3 13.7,11.7 12.55,11.7 10.85,13.4 10.85,14.25 CN1.1 12.7,14.3 C7.1
  Top 0.5: 13.6,15.55 13.25,15.2 12.5,15.2 CN1.1
  Bottom 0.25: R3.2 v13,9.75 | v15.1,10.3 16.8,8.6 18.2,8.6 19.3,7.5 30,7.5 v30.6,6.9
  Bottom 0.5: FPP.5 FPP.2 11.95,15.05 CN1.1

### Text on the board
tPlace: Foo's Lab
_bPlace: L1
_tNames: C12 | R1 | FN4 | R2 | R13 | IC2 | R14 | C7 | C8 | LED1 | SW2 | R8 | C14 | C16 | C15 | R5 | IC4 | FNP1 | D2 | R17 | R16
_bNames: D1 | C6 | CN1 | C19 | C5 | R18 | C13 | IC3 | R15 | R11 | C23 | FPP | C1 | R3 | IC1 | R6 | C20 | FN1 | C22 | C21 | BLE | R9 | C2 | C3 | C18 | R4